# Altium project uz_frontpanel_buttonboard.PrjPCB
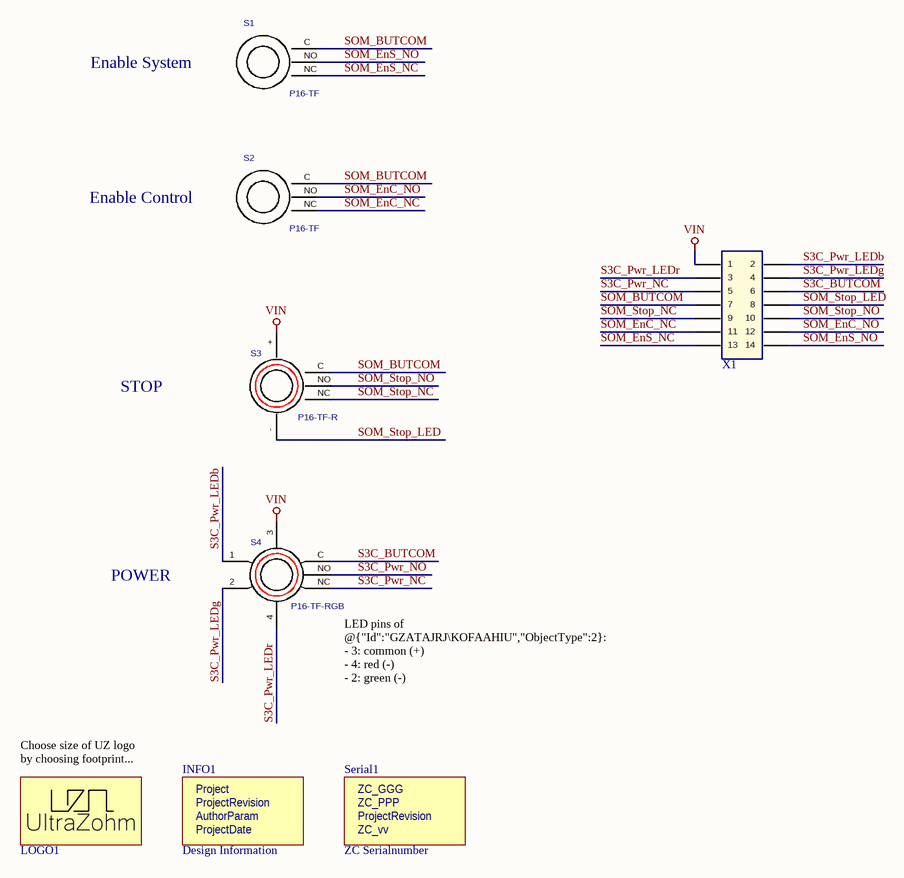
[diagram p0: TopSheet.SchDoc]
ZC_PPP: 006; ZC_GGG: 004; ProjectRevision: 02; ProjectDate: 06/26; Project: uz_frontpanel_buttonboard; AuthorParam: M. Geier / M. Hoerner
1 sheet, 8 parts. Net scope: global (net labels, ports and power ports of the same name join across sheets).
Board file: uz_frontpanel_buttonboard.PcbDoc

## Sheet TopSheet.SchDoc
size A4; Author: M. Geier / M. Hoerner; CompanyName: Technische Hochschule Nürnberg Georg Simon Ohm; Organization: UltraZohm; Address1: Kesslerplatz 12; Address2: 90489 Nürnberg; Address3: GERMANY; DocumentNumber: 1; SheetNumber: 1; SheetTotal: 2; Website: www.ultrazohm.com

### Parts
INFO1  Design Information  [Design_info2]  (no BOM)
LOGO1  UZ Logo  [UZ_Logo_tiny]  (value not drawn)  (no BOM)
S1  P16-TF  [P16-TF]  (no BOM)
S2  P16-TF  [P16-TF]  (no BOM)
S3  P16-TF-R  [P16-TF-R]  (no BOM)
S4  P16-TF-RGB  [P16-TF-RGB]  (no BOM)
Serial1  ZC Serialnumber  [ZC-Serial]  (no BOM)
X1  (no value)  [TSW-107-07-XXX-S]

### Nets
VIN: S3.+ S4.3 X1.1
S3C_BUTCOM: S4.C X1.6
S3C_Pwr_LEDb: S4.1 X1.2
S3C_Pwr_LEDg: S4.2 X1.4
S3C_Pwr_LEDr: S4.4 X1.3
S3C_Pwr_NC: S4.NC X1.5
S3C_Pwr_NO: S4.NO
SOM_BUTCOM: S1.C S2.C S3.C X1.7
SOM_EnC_NC: S2.NC X1.11
SOM_EnC_NO: S2.NO X1.12
SOM_EnS_NC: S1.NC X1.13
SOM_EnS_NO: S1.NO X1.14
SOM_Stop_LED: S3.- X1.8
SOM_Stop_NC: S3.NC X1.9
SOM_Stop_NO: S3.NO X1.10

### Notes on the sheet
- Enable System
- Enable Control
- STOP
- POWER
- (near S4) LED pins of @{"Id":"GZATAJRJ\KOFAAHIU","ObjectType":2}:
  - 3: common (+)
  - 4: red (-)
  - 2: green (-)
  - 1: blue (-)
- (near LOGO1) Choose size of UZ logo by choosing footprint...
- Title
- Revision:
- Design Engineer:
- Date:
- Project:
- Sheet
- of
- (in symbol Design Information) Project; ProjectRevision; AuthorParam; ProjectDate
- (in symbol ZC-Serial) ZC_GGG; ZC_PPP; ProjectRevision; ZC_vv

### Library data of the parts
INFO1 = Design Information: Manufacturer: UltraZohm; Created from: MGremer; Manufacturer Part Number: Design Information; PartID: 12; Created On: 03/11/2021 09:04:23; ComponentLink1Description: https://docs.ultrazohm.com/; ComponentLink1URL: homepage; Component Type: Design Information; Last Updated: 15/04/2025 09:29:36; Supplier 1: -; Supplier Part Number 1: -; Type: Design Information; Value: Design Information; Live Cycle Status: 1
LOGO1 = 1: Official Project Logo of the UltraZohm; Manufacturer: PCB Manufacturer; Manufacturer Part Number: UltraZohm Logo; Created from: T. Wendt; PartID: 1; Created On: 19.02.2021 16:55:56; ComponentLink1Description: Homepage; ComponentLink1URL: https://ultrazohm.com; Component Type: Logo; Last Updated: 02.03.2021 14:31:24; Type: Standard (No BOM); Live Cycle Status: 1
S1 S2 = P16-TF: Stainless steel push botton 0.63 inch flat; Manufacturer: Metzler; Created from: MGremer; Manufacturer Part Number: P16-TF; PartID: 8; Created On: 02.03.2021 14:59:37; ComponentLink1Description: Datasheet; ComponentLink1URL: https://www.led-taster.de/mediafiles/Sonstiges/Datenblatt_LED_Drucktaster_6-24V.pdf; ComponentLink2Description: Homepage; ComponentLink2URL: https://www.led-taster.de/Edelstahl-Drucktaster-O16mm-Flach; Component Type: push button; Device Package: THT; Last Updated: 05.07.2024 11:31:32; Minimum Order: 1; Mounting Type: THT; Supplier 1: Metzler; Supplier Part Number 1: P16-TF; Type: push button; Live Cycle Status: 1; Stock number: not stored
S3 = P16-TF-R: Stainless steel push botton 0.63 inch flat LED Ring red; Manufacturer: Metzler; Created from: MGremer; Manufacturer Part Number: P16-TF-R; PartID: 7; Created On: 02.03.2021 14:59:37; ComponentLink1Description: Datasheet; ComponentLink1URL: https://www.led-taster.de/mediafiles/Sonstiges/Datenblatt_LED_Drucktaster_6-24V.pdf; ComponentLink2Description: Homepage; ComponentLink2URL: https://www.led-taster.de/O16mm-flacher-Edelstahl-Taster-mit-roter-LED-Ringbeleuchtung; Component Type: LED push button; Device Package: THT; Last Updated: 05.07.2024 11:31:32; Minimum Order: 1; Mounting Type: THT; Supplier 1: Metzler; Supplier Part Number 1: P16-TF-R; Type: LED push button red; Live Cycle Status: 1; Stock number: not stored
S4 = P16-TF-RGB: Push button momentary 16mm - LED Circular Illumination RGB - IP67 IK10 - Stainless steel - Flat - Soldering contacts; Manufacturer: Metzler; Created from: FRosner; Manufacturer Part Number: P16-TF-RGB; PartID: 15; Created On: 03/07/2024 12:55:00; ComponentLink1Description: Datasheet; ComponentLink1URL: https://metzler-electronics.com/mediafiles/Sonstiges/Datenblatt/16/P16-TF-RGB.pdf; Component Type: LED push button; Device Package: THT; Last Updated: 05/07/2024 15:40:05; Minimum Order: 1; Mounting Type: THT; Supplier 1: Metzler; Supplier Part Number 1: P16-TF-RGB; Type: LED push button RGB; Live Cycle Status: 1; Stock number: not stored
Serial1 = ZC-Serial: Manufacturer: UltraZohm; Value: GGG-PPP-VVvv; Created from: FRosner; Manufacturer Part Number: ZC-Serial; PartID: 58; Created On: 15/04/2025 09:17:14; ComponentLink1Description: https://docs.ultrazohm.com/; ComponentLink1URL: homepage; Component Type: ZC Serialnumber; Last Updated: 15/04/2025 09:17:14; Supplier 1: -; Supplier Part Number 1: -; Type: Serial Number; Live Cycle Status: 1
X1 = 2.54-2*7P Pin Header: [low-cost] TSW-107-07-S-D Headers & Wire Housings Classic PCB Header Strips, 0.100" pitch; Manufacturer: Boom Precision Elec; Created from: FRosner; Manufacturer Part Number: 2.54-2*7P Pin Header; PartID: 45; Created On: 03.09.2024 09:19:28; ComponentLink1Description: Datasheet; ComponentLink1URL: https://www.lcsc.com/datasheet/lcsc_datasheet_2212121509_BOOMELE-Boom-Precision-Elec-2-54-2-7P_C71397.pdf; Last Updated: 03.09.2024 09:26:45; Mounting Type: THT; Operating Temperature: -55 °C to +125 °C; Supplier 1: LCSC; Supplier Part Number 1: C71397; Value: 2.54-2*7P Pin Header; LCSC Part Number: C71397

## Assembly variants
Default: all parts fitted